# Altium schematic sheet LV_power.SchDoc
size A4; SheetNumber: 6; SheetTotal: 6
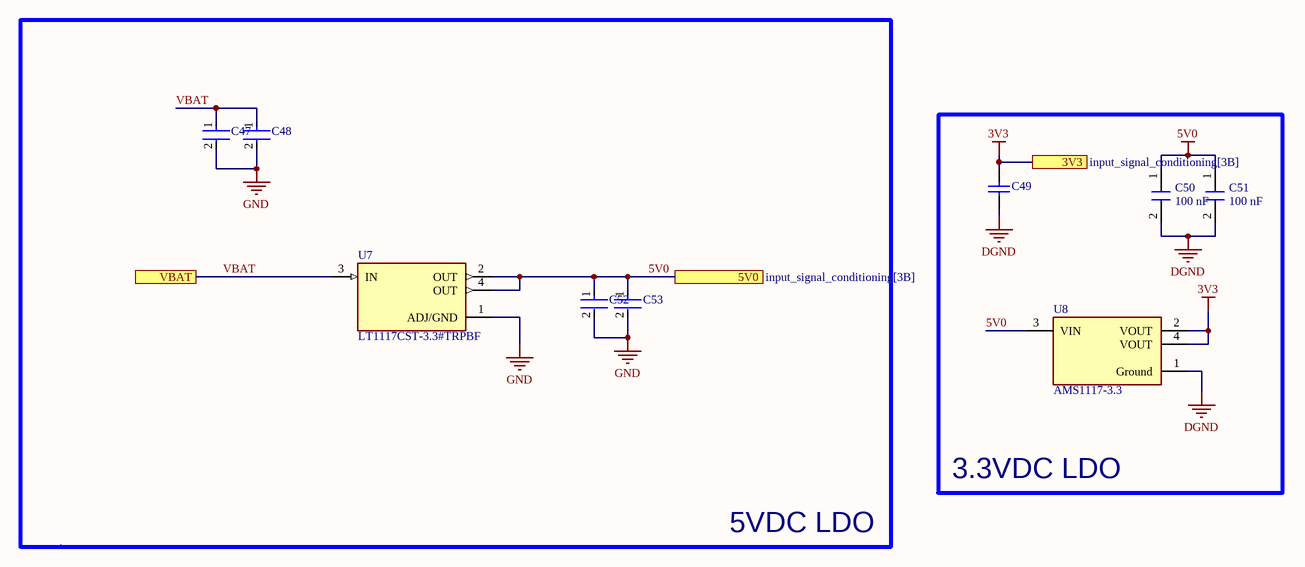
[diagram p0: LV_power.SchDoc]

## Parts
C47  CC0805MKX5R8BB226  [FP-CC0805-0_2-1_45-IPC_C]  (value not drawn)
C48  CC0805MKX5R8BB226  [FP-CC0805-0_2-1_45-IPC_C]  (value not drawn)
C49  0805ZG106ZAT2A  [CAPC2013X152X50NL20T25]  (value not drawn)
C50  value 100 nF  [0603_FP]  (hidden comment: Capacitor_0603)
C51  value 100 nF  [0603_FP]  (hidden comment: Capacitor_0603)
C52  GRM21BR61A476ME15K  [FP-GRM21B-0_2-e0_2_0_7-IPC_B]  (value not drawn)
C53  GRM21BR61A476ME15K  [FP-GRM21B-0_2-e0_2_0_7-IPC_B]  (value not drawn)
U7  LT1117CST-3.3#TRPBF  [REG_LT1117CST-3.3#TRPBF]
U8  AMS1117-3.3  [FP-AMS1117-IPC_C]

## Blocks framed on the sheet
5VDC LDO: C47 C48 C52 C53 U7
3.3VDC LDO: C49-C51 U8

## Ports
3V3 (see input_signal_conditioning[3B]), 5V0 (see input_signal_conditioning[3B]), VBAT (see cd_switching[3A], cd_switching[3B], HV_power[1C], input_output[2D])

## Nets
3V3: C49.2 U8.2(VOUT) U8.4(VOUT) ; port 3V3
5V0: C50.1 C51.1 C52.1 C53.1 U7.2(OUT) U7.4(OUT) U8.3(VIN) ; port 5V0
DGND: C49.1 C50.2 C51.2 U8.1(Ground)
GND: C47.2 C48.2 C52.2 C53.2 U7.1(ADJ/GND)
VBAT: C47.1 C48.1 U7.3(IN) ; port VBAT

## Library data of the parts
C47 C48 = CMP-03422-001497-1: CAP CER 22UF 25V X5R 0805; Tolerance: 20%; Max Operating Temperature: 85°C; Dielectric: X5R; Termination: SMD/SMT; Voltage Rating: 25V; Width: 0.049inch; Min Operating Temperature: -55°C; Case/Package: 0805; Lead Free: Lead Free; RoHS Compliant: Yes; Weight: 0.000194oz; Voltage Rating (DC): 25V; Capacitance: 22uF; Length: 0.079inch; Halogen Free: Halogen Free; Height: 1.25mm; Packaging: Tape and Reel; Package Quantity: 3000; Case Code (Metric): 2012; Thickness: 0.057inch; Case Code (Imperial): 0805; Mount: Surface Mount
C49 = CMP-2007-04523-1: Manufacturer: AVX Interconnect / Elco; Part Number: 0805ZG106ZAT2A
C50 C51 = Capacitor_0603: Format: 0402; Package: 0402
C52 C53 = CMP-06035-042633-1: Chip Multilayer Ceramic Capacitors for General Purpose, 0805, 47uF, X5R, 15%, 20%, 10V; Min Operating Temperature: -55°C; Max Operating Temperature: 85°C; Length: 0.079inch; Case Code (Imperial): 0805; Tolerance: 20%; Mount: Surface Mount; Voltage Rating (DC): 10V; Termination: SMD/SMT; Voltage Rating: 10V; Weight: 0.000335oz; Package Quantity: 10000; Dielectric: X5R; Thickness: 0.057inch; Capacitance: 47uF; Case/Package: 0805; Width: 0.049inch; Case Code (Metric): 2012; Packaging: Tape and Reel
U7 = LT1117CST-3.3#TRPBF: LT1117 - 800mA Low Dropout Positive Regulators Adjustable and Fixed 2.85V, 3.3V, 5V; MF: {'manufacturer': u'Analog Devices Inc.'}; Package: None; Price: None; Value: *; MP: LT1117CST-3.3#TRPBF; Availability: Unavailable
U8 = CMP-209535-000001-1: LDO Voltage Regulators 1A, 3.3V; Manufacturer: Advanced Monolithic Systems; Dropout Voltage: 1.1V; Output Type: Fixed; Nominal Supply Current: 5mA; Max Power Dissipation: 1.2W; Max Supply Voltage: 15V; Number Of Outputs: 1; Standoff Height: 0.64mm; Max Junction Temp: +125°C; Height: 1.8mm; Package: AMS1117; Device Class L2: Power Management ICs; ComponentLink2Description: Datasheet; ComponentLink2URL: http://www.advanced-monolithic.com/pdf/ds1117.pdf; Category: IC; RoHS: TRUE; Automotive: No; Device Class L1: Integrated Circuits (ICs); Output Current: 1A; Device Class L3: Voltage Regulators - Linear; Temperature: -40°C to +125°C; Output Voltage: 3.3V; Manufacturer Part Number: AMS1117-3.3; Temperature Range Low: -40°C; Octopart: https://octopart.com/ams1117-3.3-advanced+monolithic+systems-25899300; Lead Free: Yes; Ipc Land Pattern Name: SOT229P700X180-4; Temperature Range High: +125°C